# Altium schematic sheet 3.POWER.SchDoc
size A4
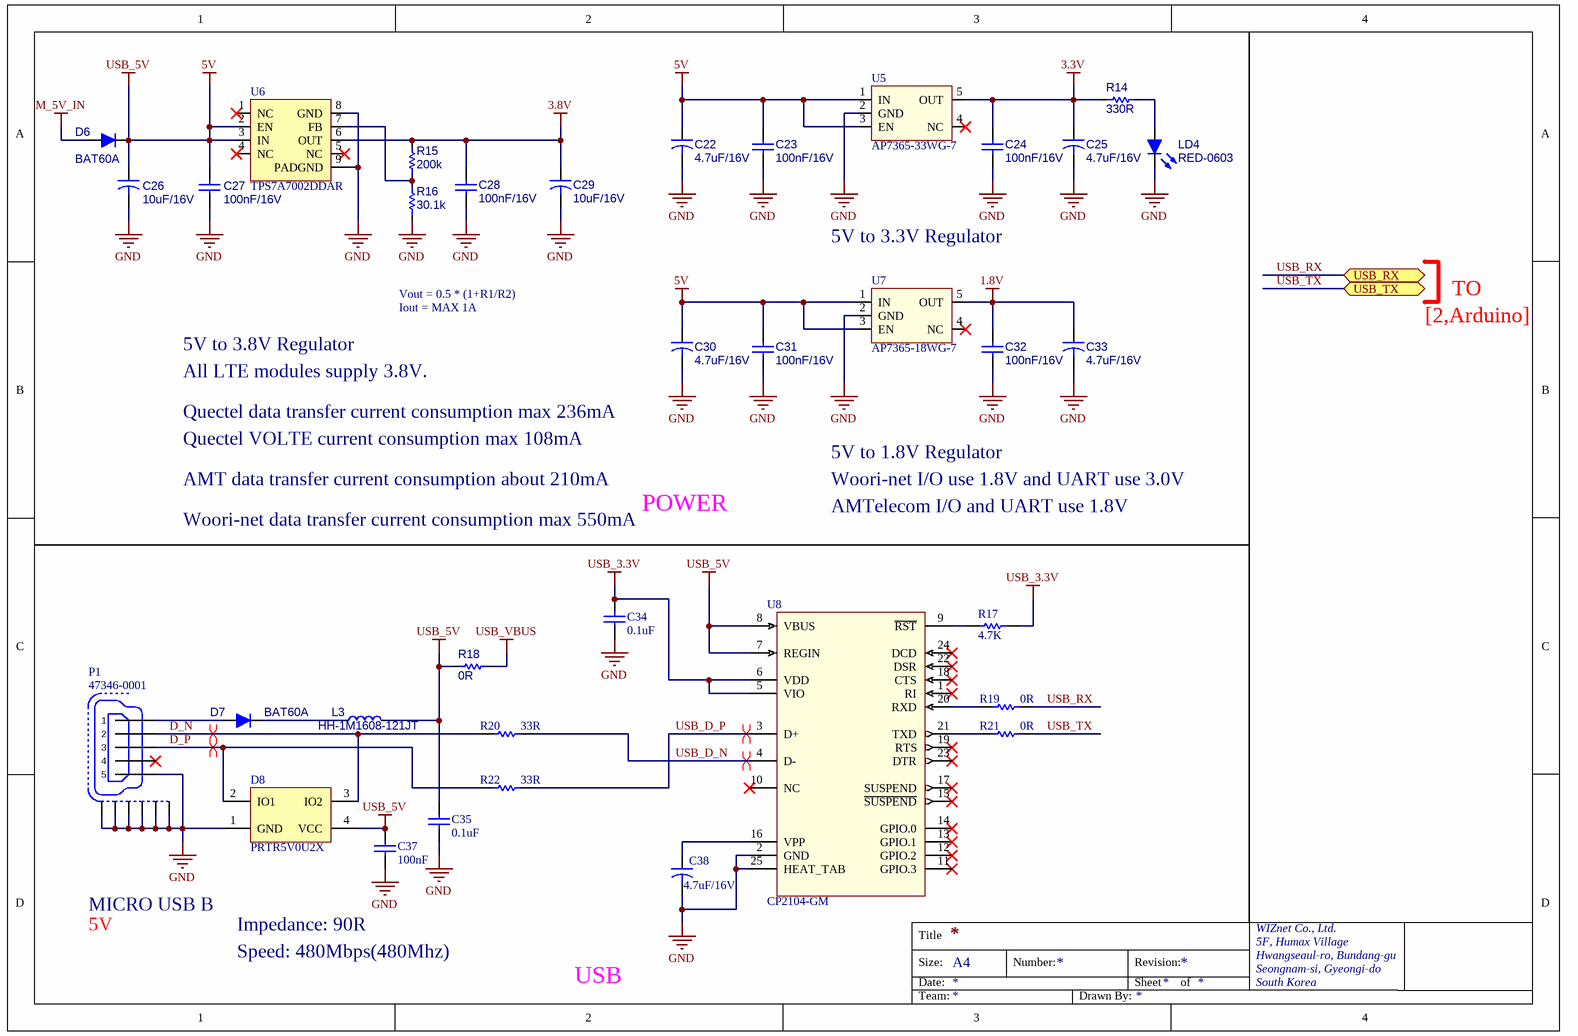
[diagram p0: 3.POWER.SchDoc]

## Parts
C22  4.7uF/16V  [CAP-A Size]
C23  100nF/16V  [CAP-0603]
C24  100nF/16V  [CAP-0603]
C25  4.7uF/16V  [CAP-A Size]
C26  10uF/16V  [CAP-A Size]
C27  100nF/16V  [CAP-0603]
C28  100nF/16V  [CAP-0603]
C29  10uF/16V  [CAP-A Size]
C30  4.7uF/16V  [CAP-A Size]
C31  100nF/16V  [CAP-0603]
C32  100nF/16V  [CAP-0603]
C33  4.7uF/16V  [CAP-A Size]
C34  0.1uF  [CAP-0603]
C35  0.1uF  [CAP-0603]
C37  100nF  [CAP-0603]
C38  4.7uF/16V  [CAP-A Size]
D6  BAT60A  [SOD-323(1-C,2-A)]
D7  BAT60A  [SOD-323(1-C,2-A)]
D8  PRTR5V0U2X  [SOT-143]
L3  HH-1M1608-121JT  [IND-0603]
LD4  RED-0603  [LED-0603-RED]
P1  47346-0001  [USB-MOLEX-47346]
R14  330R  [RES-0402]
R15  200k  [RES-0603]
R16  30.1k  [RES-0603]
R17  4.7K  [RES-0603]
R18  0R  [RES-0402]
R19  0R  [RES-0603]
R20  33R  [RES-0603]
R21  0R  [RES-0603]
R22  33R  [RES-0603]
U5  AP7365-33WG-7  [SOT-25]
U6  TPS7A7002DDAR  [SO-08-EP]
U7  AP7365-18WG-7  [SOT-25]
U8  CP2104-GM  [QFN24(0.5/4X4)]

## Ports
USB_RX, USB_TX

## Nets
1.8V: C32.2 C33.1 U7.5(OUT)
3.3V: C24.2 C25.1 R14.1 U5.5(OUT)
3.8V: C28.2 C29.1 R15.2 U6.6(OUT)
5V: C22.1 C23.2 C26.1 C27.2 C30.1 C31.2 C35.2 C37.2 D6.1(K) D8.4(VCC) L3.2 R18.1 U5.1(IN) U5.3(EN) U6.2(EN) U6.3(IN) U7.1(IN) U7.3(EN) U8.7(REGIN) U8.8(VBUS)  [also labelled USB_5V]
GND: C22.2 C23.1 C24.1 C25.2 C26.2 C27.1 C28.1 C29.2 C30.2 C31.1 C32.1 C33.2 C34.1 C35.1 C37.1 C38.2 D8.1(GND) LD4.2(K) P1.5 P1.6 P1.7 P1.8 P1.9 P1.10 P1.11 R16.1 U5.2(GND) U6.8(GND) U6.9(PADGND) U7.2(GND) U8.2(GND) U8.25(HEAT_TAB)
M_5V_IN: D6.2(A)
USB_3.3V: C34.2 R17.2 U8.5(VIO) U8.6(VDD)
USB_VBUS: R18.2
D_N: D8.3(IO2) P1.2 R20.1
D_P: D8.2(IO1) P1.3 R22.1
USB_D_N: R20.2 U8.4(D-)
USB_D_P: R22.2 U8.3(D+)
USB_RX: R19.2 ; port USB_RX
USB_TX: R21.2 ; port USB_TX
NetC38_1: C38.1 U8.16(VPP)
NetD7_1: D7.1(K) L3.1
NetD7_2: D7.2(A) P1.1
NetLD4_1: LD4.1(A) R14.2
NetR15_1: R15.1 R16.2 U6.7(FB)
NetR17_1: R17.1 U8.9(~{RST})
NetR19_1: R19.1 U8.20(RXD)
NetR21_1: R21.1 U8.21(TXD)

Not connected (* = marked no-connect by the designer): P1 4*; U5 4(NC)*; U6 1(NC)* 4(NC)* 5(NC)*; U7 4(NC)*; U8 1(RI)* 10(NC)* 11(GPIO.3)* 12(GPIO.2)* 13(GPIO.1)* 14(GPIO.0)* 15(~{SUSPEND})* 17(SUSPEND)* 18(CTS)* 19(RTS)* 22(DSR)* 23(DTR)* 24(DCD)*

## Layout directives
differential pair: D_N, D_P, USB_D_N, USB_D_P

## Notes on the sheet
- 5V to 3.3V Regulator
- Vout = 0.5 * (1+R1/R2)
- Iout = MAX 1A
- TO
- 5V to 3.8V Regulator
- All LTE modules supply 3.8V.
- [2,Arduino]
- (near C30) Quectel data transfer current consumption max 236mA
- Quectel VOLTE current consumption max 108mA
- AMT data transfer current consumption about 210mA
- POWER
- 5V to 1.8V Regulator
- Woori-net I/O use 1.8V and UART use 3.0V
- AMTelecom I/O and UART use 1.8V
- Woori-net data transfer current consumption max 550mA
- MICRO USB B
- 5V
- Impedance: 90R
- Speed: 480Mbps(480Mhz)
- USB
- Title
- Size:
- Date:
- A4
- Number:
- Revision:
- Sheet
- of
- WIZnet Co., Ltd.
- 5F, Humax Village
- Hwangseaul-ro, Bundang-gu
- Seongnam-si, Gyeongi-do
- South Korea
- Team:
- Drawn By:

## Library data of the parts
C22 C25 C26 C29 C30 C33 = CAP-A Size: Tantal CAP A Size EIA/IECQ 3216
C23 C24 C27 C28 C31 C32 C34 C35 C37 = CAP-0603: Ceramic CAP 0603(1608)
C38 = CAP-A Size: Tantla CAP A Size EIA/IECQ 3216
D6 D7 = DIODE-BAT60A: Silicon Schottky Diode
D8 = PRTR5V0U2X: Ultra low capacitance double rail-to-rail ESD protection diode; Manufacturer: NXP; 2nd source part number: 152-4157; Artikkelnr Noca: 10069015; Artikkelnr Simpro: N.A.; Part Number: PRTR5V0U2X; Manufacturer Part Number: PRTR5V0U2X; Datasheet: http://www.farnell.com/datasheets/109718.pdf; LatestRevisionDate: 2012-06-11; Publisher: Nordic Semiconductor; Published: 2012-06-11; Value: PRTR5V0U2X; Note: *; Supplier: Digi-Key; Supplier part number: 568-4140-1-ND; 2nd source Supplier: Farnell; Footprint Doc: SOT-143B
L3 = IND-0603: Inductor 0603(1608)
LD4 = LED-0603
P1 = 47346-0001: MICRO USB B Type
R14 R18 = RES-0402
R15 R16 = RES-0603: RES0603
R17 R19-R22 = RES-0603
U5 U7 = AP7365-33WG-7: 3.3V 600mA Regulator/SOT25(Fixed Output)
U8 = CP2104-GM: USB to UART Bridge, SiliconLabs; RefDes: RefDes; Type: Type; Value: Value